# Altium schematic sheet connector-schematic.SchDoc
size A3
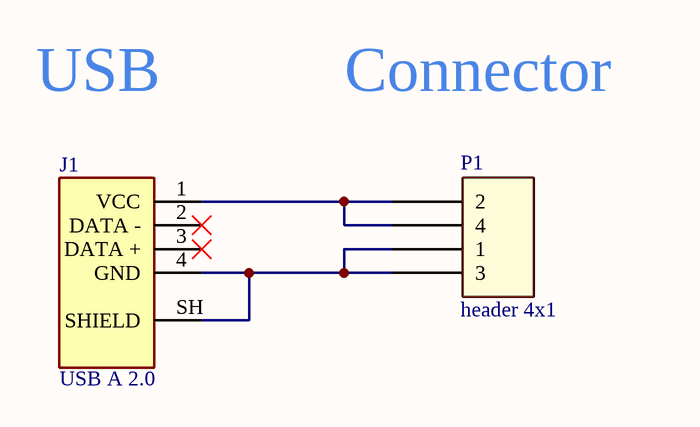
[diagram p0: connector-schematic.SchDoc]

## Parts
J1  USB A 2.0  [0480372100]
P1  header 4x1  [4x1, 2.54mm, smd side]

## Nets
NetJ1_1: J1.1(VCC) P1.2 P1.4
NetJ1_4: J1.4(GND) J1.SH(SHIELD) P1.1 P1.3

Not connected (* = marked no-connect by the designer): J1 2(DATA_-)* 3(DATA_+)*

## Notes on the sheet
- USB
- Connector
- 1
- 2
- 3
- 4
- 5
- 6
- 7
- 8
- A
- B
- C
- D
- Project:
- Date:
- Drawing number:
- Rev:
- Format:
- A3
- Drawn by:
- Laboratory:
- Page
- Sheet:
- of
- File:

## Library data of the parts
J1 = USB A 2.0: Type A, USB 2.0, 1 A, Vertical, Through Hole, USB Receptacle; MP: UJ2-AV-2-TH; MF: CUI Devices; Package: None; SnapEDA_Link: https://www.snapeda.com/parts/UJ2-AV-2-TH/CUI%20Devices/view-part/2779619/?ref=snap; CUI_purchase_URL: https://www.cuidevices.com/product/interconnect/connectors/usb-connectors/uj2-av-th-series?utm_source=snapeda.com&utm_medium=referral&utm_campaign=snapedaBOM; Mouser-Purchase-URL: https://snapeda.com/shop?store=Mouser&id=2779619; DigiKey-Purchase-URL: https://snapeda.com/shop?store=DigiKey&id=2779619; Value: *; Digi-Key_Part_Number: 102-5880-ND